# Altium schematic sheet sheet1.SchDoc
size A4; SheetNumber: 1; SheetTotal: 1
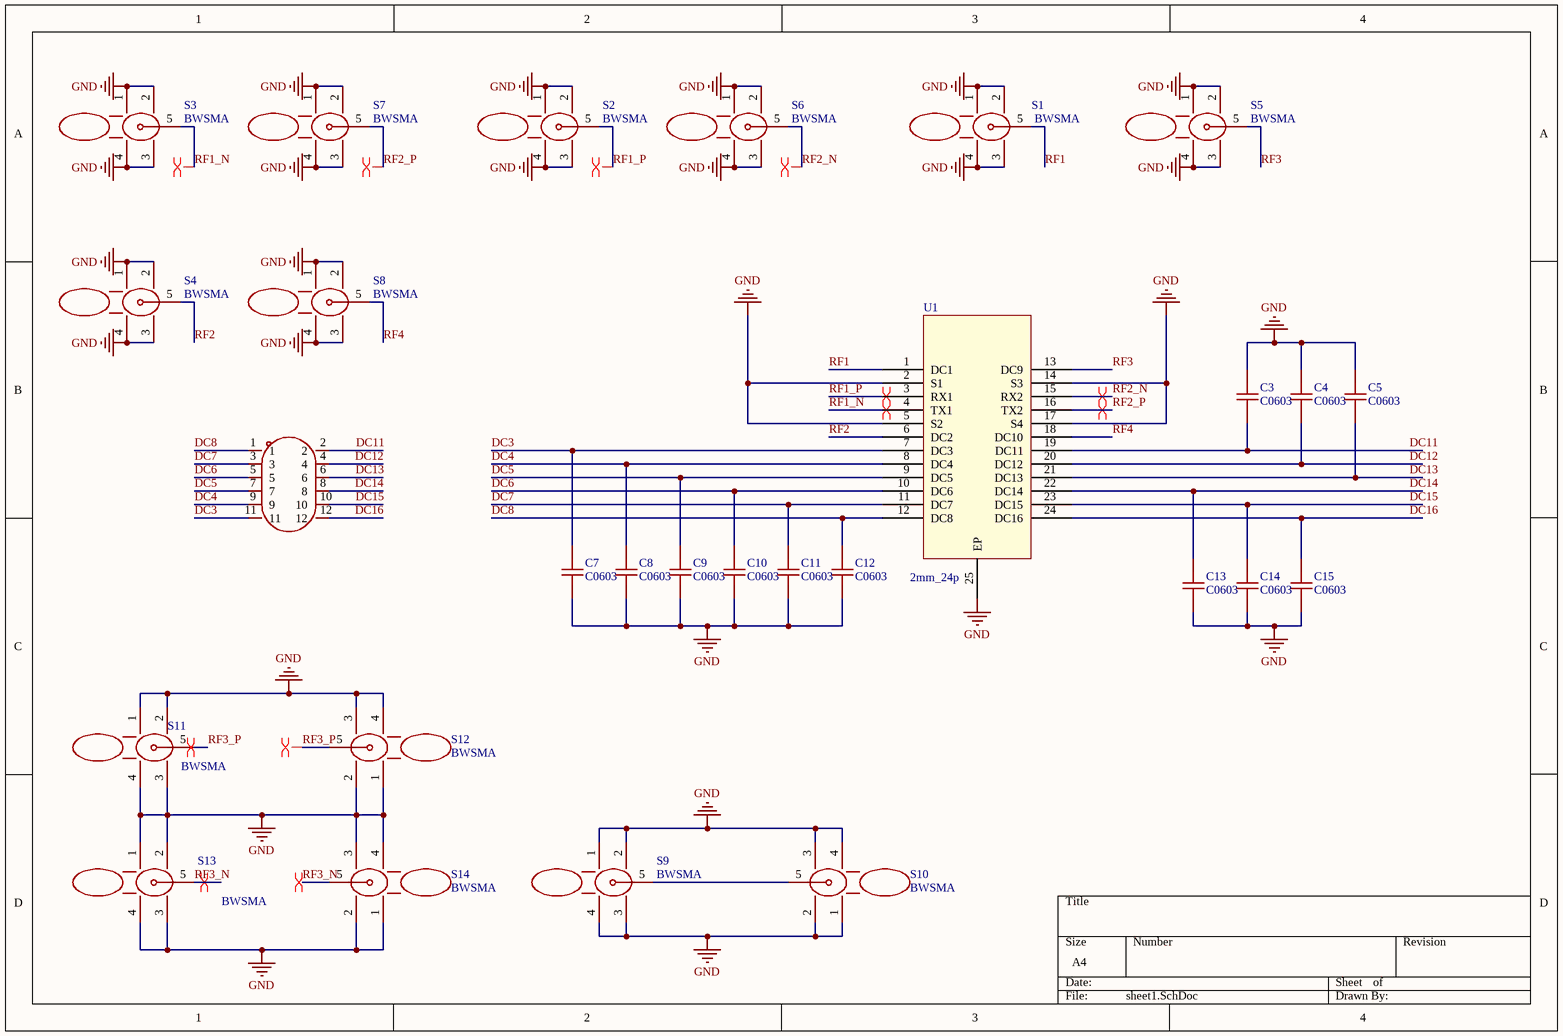
[diagram p0: sheet1.SchDoc]

## Parts
C3  C0603  [C0603]
C4  C0603  [C0603]
C5  C0603  [C0603]
C7  C0603  [C0603]
C8  C0603  [C0603]
C9  C0603  [C0603]
C10  C0603  [C0603]
C11  C0603  [C0603]
C12  C0603  [C0603]
C13  C0603  [C0603]
C14  C0603  [C0603]
C15  C0603  [C0603]
S1  BWSMA  [BWSMA]
S2  BWSMA  [BWSMA]
S3  BWSMA  [BWSMA]
S4  BWSMA  [BWSMA]
S5  BWSMA  [BWSMA]
S6  BWSMA  [BWSMA]
S7  BWSMA  [BWSMA]
S8  BWSMA  [BWSMA]
S9  BWSMA  [BWSMA]
S10  BWSMA  [BWSMA]
S11  BWSMA  [BWSMA]
S12  BWSMA  [BWSMA]
S13  BWSMA  [BWSMA]
S14  BWSMA  [BWSMA]
U1  2mm_24p  [2MM_8AC_16DC]
U2  HX PZ2.54-2x6P ZZ  [2*6]  (value not drawn)

## Nets
GND: C3.2 C4.2 C5.2 C7.1 C8.1 C9.1 C10.1 C11.1 C12.1 C13.1 C14.1 C15.1 S1.1 S1.2 S1.3 S1.4 S2.1 S2.2 S2.3 S2.4 S3.1 S3.2 S3.3 S3.4 S4.1 S4.2 S4.3 S4.4 S5.1 S5.2 S5.3 S5.4 S6.1 S6.2 S6.3 S6.4 S7.1 S7.2 S7.3 S7.4 S8.1 S8.2 S8.3 S8.4 S9.1 S9.2 S9.3 S9.4 S10.1 S10.2 S10.3 S10.4 S11.1 S11.2 S11.3 S11.4 S12.1 S12.2 S12.3 S12.4 S13.1 S13.2 S13.3 S13.4 S14.1 S14.2 S14.3 S14.4 U1.2(S1) U1.5(S2) U1.14(S3) U1.17(S4) U1.25(EP)
DC3: C7.2 U1.7(DC3) U2.11
DC4: C8.2 U1.8(DC4) U2.9
DC5: C9.2 U1.9(DC5) U2.7
DC6: C10.2 U1.10(DC6) U2.5
DC7: C11.2 U1.11(DC7) U2.3
DC8: C12.2 U1.12(DC8) U2.1
DC11: C3.1 U1.19(DC11) U2.2
DC12: C4.1 U1.20(DC12) U2.4
DC13: C5.1 U1.21(DC13) U2.6
DC14: C13.2 U1.22(DC14) U2.8
DC15: C14.2 U1.23(DC15) U2.10
DC16: C15.2 U1.24(DC16) U2.12
RF1: S1.5 U1.1(DC1)
RF1_N: S3.5 U1.4(TX1)
RF1_P: S2.5 U1.3(RX1)
RF2: S4.5 U1.6(DC2)
RF2_N: S6.5 U1.15(RX2)
RF2_P: S7.5 U1.16(TX2)
RF3: S5.5 U1.13(DC9)
RF3_N: S13.5 S14.5
RF3_P: S11.5 S12.5
RF4: S8.5 U1.18(DC10)
NetS9_5: S9.5 S10.5

## Layout directives
differential pair: RF1_N, RF1_P, RF2_N, RF2_P, RF3_N, RF3_P

## Library data of the parts
U2 = HX PZ2.54-2x6P ZZ: Manufacturer: hanxia(韩下); Add into BOM: yes; Pin Structure: 2x6P; Pitch: 2.54mm; Circluar Pins/Square Pins: Policy; Current Rating: 3A; Symbol: HX PZ2.54-2X6P ZZ; Device: HX PZ2.54-2x6P ZZ; LCSC Part Name: 2x6P 间距:2.54mm 方针 直插; Supplier Part: C32713279; Manufacturer Part: HX PZ2.54-2x6P ZZ; Supplier Footprint: 插件,P=2.54mm; JLCPCB Part Class: Extended Part; Datasheet: https://atta.szlcsc.com/upload/public/pdf/source/20240723/7CFD6BBE81D942E4FB6053E60626E655.pdf; Supplier: LCSC; Convert to PCB: yes; Row Spacing: 2.54mm; Mounting Type: Straight; Number of Rows: Double Row; Number of Pins: 12P; Voltage Rating (Max): -; Length of Mating Pin: 6mm; Insulation Height: 2.5mm; Length of End Connection Pin: 3mm; Contact Material: Brass; Contact Plating: Gold; Operating Temperature: -40℃~+105℃; Color: Black